# Altium schematic sheet ADC_channel.SchDoc: =ProjectName
size 420 x 297 mm; Author: SBH; CompanyName: WUT; DrawnBy: SBH; Organization: ISE-WUT; Address1: Warsaw Univeristy of Technology; Address2: Nowowiejska 15/19; Revision: -; SheetNumber: -; SheetTotal: -; EDA_Number: ARTIQ; Projet: ADC/DAC MEZZANINE; ModifiedBy: -; CreateDate: XX/XX/XXXX; CheckedDate: -; Title2: ADC_channel.SchDoc; DivGrp: ISE; Designer: SBH; ModifiedDate: -; ProjectName: ADC/DAC MEZZANINE
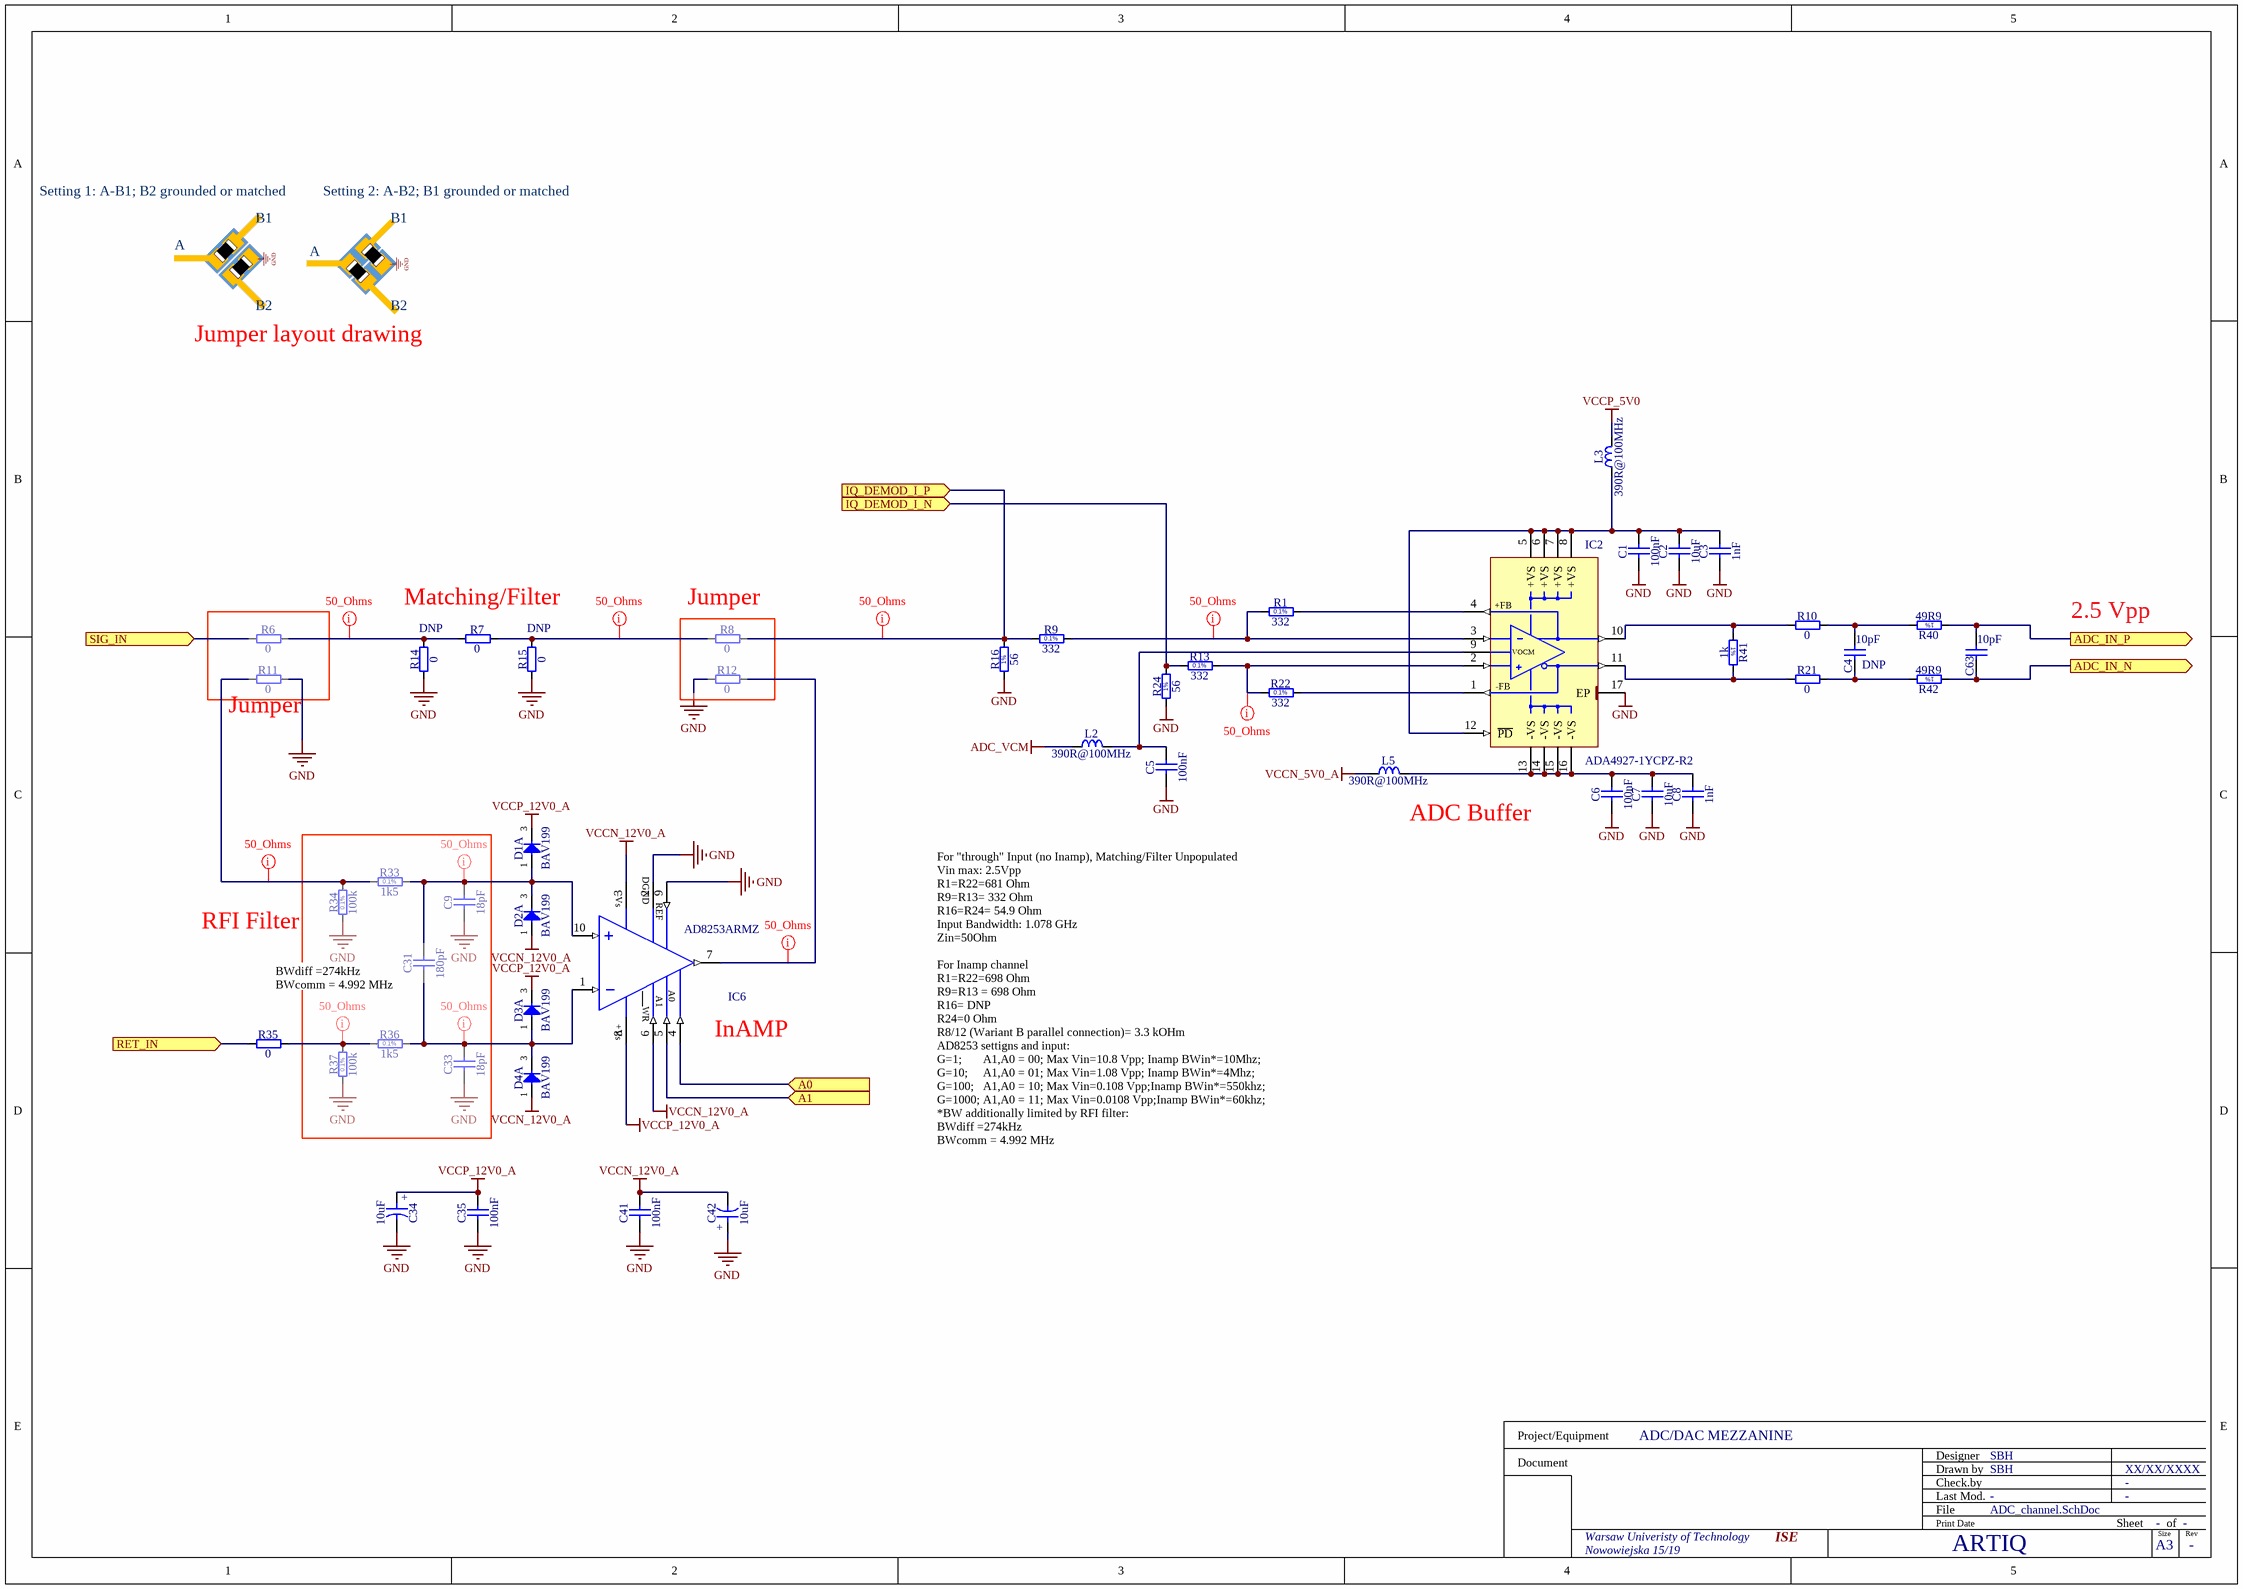
[diagram p0: ADC_channel.SchDoc]

## Parts
C1  100nF  [CAPC1005X55N]
C2  10uF  [CAPC1608X87N]
C3  1nF  [CAPC1005X55N]
C4  10pF  Mounted: DNP  [CAPC1608X87N]
C5  100nF  [CAPC1005X55N]
C6  100nF  [CAPC1005X55N]
C7  10uF  [CAPC1608X87N]
C8  1nF  [CAPC1005X55N]
C9  18pF  [CAPC1005X55N]
C31  180pF  [CAPC3216X140N]
C33  18pF  [CAPC1005X55N]
C34  10uF  [CAPMP3216X180N]
C35  100nF  [CAPC1005X55N]
C41  100nF  [CAPC1005X55N]
C42  10uF  [CAPMP3216X180N]
C63  10pF  [CAPC1608X87N]
D1  BAV199  [SOT95P240X110-3N]  (part A of 2)
D2  BAV199  [SOT95P240X110-3N]  (part A of 2)
D3  BAV199  [SOT95P240X110-3N]  (part A of 2)
D4  BAV199  [SOT95P240X110-3N]  (part A of 2)
IC2  ADA4927-1YCPZ-R2  [QFN50P300X300X100-17N-S145]
IC6  AD8253ARMZ  [SOP50P490X110-10N]
L2  390R@100MHz  [INDC1608X95N]
L3  390R@100MHz  [INDC1608X95N]
L5  390R@100MHz  [INDC1608X95N]
R1  332  [RESC1608X55N]
R6  0  [RESC1005X40N]
R7  0  [RESC1005X40N]
R8  0  [RESC1005X40N]
R9  332  [RESC1608X55N]
R10  0  [RESC1005X40N]
R11  0  [RESC1005X40N]
R12  0  [RESC1005X40N]
R13  332  [RESC1608X55N]
R14  0  Mounted: DNP  [RESC1005X40N]
R15  0  Mounted: DNP  [RESC1005X40N]
R16  56  [RESC1005X40N]
R21  0  [RESC1005X40N]
R22  332  [RESC1608X55N]
R24  56  [RESC1005X40N]
R33  1k5  [RESC1608X55N]
R34  100k  [RESC1005X35N]
R35  0  [RESC1005X40N]
R36  1k5  [RESC1608X55N]
R37  100k  [RESC1005X35N]
R40  49R9  [RESC1005X40N]
R41  1k  [RESC1005X40N]
R42  49R9  [RESC1005X40N]

## Blocks framed on the sheet
Jumper: R8 R12

## Ports
A0 (in), A1 (in), ADC_IN_N (out), ADC_IN_P (out), IQ_DEMOD_I_N (in), IQ_DEMOD_I_P (in), RET_IN (in), SIG_IN (in)

## Nets
ADC_VCM: L2.1
GND: C1.1 C2.1 C3.1 C5.1 C6.1 C7.1 C8.1 C9.1 C33.1 C34.2 C35.1 C41.1 C42.1 IC2.17(EP) IC6.2(DGND) IC6.9(REF) R11.2 R12.2 R14.1 R15.1 R16.1 R24.1 R34.1 R37.1
VCCN_5V0_A: L5.1
VCCN_12V0_A: C41.2 C42.2 D2.1(A) D4.1(A) IC6.3(-VS) IC6.6(~{WR})
VCCP_5V0: L3.2
VCCP_12V0_A: C34.1 C35.2 D1.3(COMAC) D3.3(COMAC) IC6.8(+VS)
A0: IC6.4(A0) ; port A0
A1: IC6.5(A1) ; port A1
ADC_IN_N: C63.1 R42.1 ; port ADC_IN_N
ADC_IN_P: C63.2 R40.1 ; port ADC_IN_P
IQ_DEMOD_I_N: R13.1 R24.2 ; port IQ_DEMOD_I_N
IQ_DEMOD_I_P: R8.1 R9.1 R16.2 ; port IQ_DEMOD_I_P
RET_IN: R35.1 ; port RET_IN
SIG_IN: R6.1 ; port SIG_IN
NetC1_2: C1.2 C2.2 C3.2 IC2.5(+VS) IC2.6(+VS) IC2.7(+VS) IC2.8(+VS) IC2.12(~{PD}) L3.1
NetC4_1: C4.1 R21.2 R42.2
NetC4_2: C4.2 R10.2 R40.2
NetC5_2: C5.2 IC2.9(VOCM) L2.2
NetC6_2: C6.2 C7.2 C8.2 IC2.13(-VS) IC2.14(-VS) IC2.15(-VS) IC2.16(-VS) L5.2
NetC9_2: C9.2 C31.2 D1.1(A) D2.3(COMAC) IC6.10(+IN) R33.2
NetC31_1: C31.1 C33.2 D3.1(A) D4.3(COMAC) IC6.1(-IN) R36.2
NetIC2_1: IC2.1(-FB) R22.2
NetIC2_2: IC2.2(+IN) R13.2 R22.1
NetIC2_3: IC2.3(-IN) R1.1 R9.2
NetIC2_4: IC2.4(+FB) R1.2
NetIC2_10: IC2.10(+OUT) R10.1 R41.1
NetIC2_11: IC2.11(-OUT) R21.1 R41.2
NetIC6_7: IC6.7(OUT) R12.1
NetR6_2: R6.2 R7.1 R14.2
NetR7_2: R7.2 R8.2 R15.2
NetR11_1: R11.1 R33.1 R34.2
NetR35_2: R35.2 R36.1 R37.2

## Layout directives
net class 50_Ohms: IQ_DEMOD_I_P, NetC9_2, NetC31_1, NetIC2_2, NetIC2_3, NetIC6_7, NetR6_2, NetR7_2, NetR11_1, NetR35_2

## Notes on the sheet
- Setting 1: A-B1; B2 grounded or matched
- A
- B1
- Setting 2: A-B2; B1 grounded or matched
- B2
- Jumper layout drawing
- Matching/Filter
- 2.5 Vpp
- (near R11) Jumper
- (near L5) ADC Buffer
- (near R34) RFI Filter
- (near C31) BWdiff =274kHz
  BWcomm = 4.992 MHz
- (near IC6) InAMP
- For "through" Input (no Inamp), Matching/Filter Unpopulated
  Vin max: 2.5Vpp
  R1=R22=681 Ohm
  R9=R13= 332 Ohm
  R16=R24= 54.9 Ohm
  Input Bandwidth: 1.078 GHz
  Zin=50Ohm
  For Inamp channel
  R1=R22=698 Ohm
  R9=R13 = 698 Ohm
  R16= DNP
  R24=0 Ohm
  R8/12 (Wariant B parallel connection)= 3.3 kOHm
  AD8253 settigns and input:
  G=1;       A1,A0 = 00; Max Vin=10.8 Vpp; Inamp BWin*=10Mhz;
  G=10;     A1,A0 = 01; Max Vin=1.08 Vpp; Inamp BWin*=4Mhz;
  G=100;   A1,A0 = 10; Max Vin=0.108 Vpp;Inamp BWin*=550khz;
  G=1000; A1,A0 = 11; Max Vin=0.0108 Vpp;Inamp BWin*=60khz;
  *BW additionally limited by RFI filter:
  BWdiff =274kHz
  BWcomm = 4.992 MHz
- Project/Equipment
- Document
- Designer
- Drawn by
- Check.by
- File
- Last Mod.
- Print Date
- Sheet
- Size
- A3
- of
- Rev
- (in symbol AD8253ARMZ) -Vs; WR; +Vs
- (in symbol CTE3216-18_10UF_16V_20%_AVX_TCJ) +
- (in symbol R0402_1K_1%_0.0625W_100PPM) 1%
- (in symbol R0402_49R9_1%_0.0625W_100PPM) 1%
- (in symbol R0402_56R_1%_0.0625W_100PPM) 1%
- (in symbol R0402_100K_0.1%_0.063W_25PPM) 0.1%
- (in symbol R0603_1K5_0.1%_0.063W_10PPM) 0.1%
- (in symbol R0603_332R_0.1%_0.063W_10PPM) 0.1%

## Library data of the parts
C1 C5 C6 = CC0402_100NF_16V_10%_X5R: Non-polarised capacitor; Part Description: SMD Multilayer Chip Ceramic Capacitor; Manufacturer: GENERIC; Manufacturer1 Part Number: GRM155R61C104KA88D; Voltage: 16V; TC: X5R; Tolerance: ±10%; Part Number: CC0402_100NF_16V_10%_X5R; Component Kind: Standard; Component Type: Standard; Pin Count: 2; Value: 100nF; Status: None; Manufacturer Part Number: CC0402_100NF_16V_10%_X5R; Case: 0402; Mounted: Yes; Socket: No; SMD: Yes; Sense: No; Manufacturer1 Example: MURATA; Manufacturer1 ComponentHeight: 0.55mm; HelpURL: \\cern.ch\dfs\Applications\Altium\Datasheets\CC0402_X5R_MURATA_GRM.pdf; Author: CERN DEM JLC; CreateDate: 10.12.2013; LatestRevisionDate: 10.12.2013
C2 C7 = CC0603_10UF_6.3V_20%_X5R: Non-polarised capacitor; Part Description: SMD Multilayer Chip Ceramic Capacitor; Manufacturer: GENERIC; Manufacturer1 Part Number: C0603C106M9PAC; Voltage: 6.3V; TC: X5R; Tolerance: ±20%; Part Number: CC0603_10UF_6.3V_20%_X5R; Component Kind: Standard; Component Type: Standard; Pin Count: 2; Value: 10uF; Status: Preferred; Manufacturer Part Number: CC0603_10uF_6.3V_20%_X5R; Case: 0603; Mounted: Yes; Socket: No; SMD: Yes; Sense: No; Manufacturer1 Example: KEMET; Manufacturer1 ComponentHeight: 0.95mm; HelpURL: \\cern.ch\dfs\Applications\Altium\Datasheets\CC0603_X5R_KEMET.pdf; Author: CERN DEM JLC; CreateDate: 03.12.2007; LatestRevisionDate: 03.12.2007
C3 C8 = CC0402_1NF_50V_10%_X7R: Non-polarised capacitor; Part Description: SMD Multilayer Chip Ceramic Capacitor; Manufacturer: GENERIC; Manufacturer1 Part Number: 223858715623; Voltage: 50V; TC: X7R; Tolerance: ±10%; Part Number: CC0402_1NF_50V_10%_X7R; Component Kind: Standard; Component Type: Standard; Pin Count: 2; Value: 1nF; Status: Not Recommended; Manufacturer Part Number: CC0402_1NF_50V_10%_X7R; Case: 0402; Mounted: Yes; Socket: No; SMD: Yes; Sense: No; Manufacturer1 Example: PHYCOMP; Manufacturer1 ComponentHeight: 0.55mm; HelpURL: \\cern.ch\dfs\Applications\Altium\Datasheets\CC0402_X7R_PHYCOMP.pdf; Author: CERN DEM JLC; CreateDate: 03.12.2007; LatestRevisionDate: 03.12.2007
C4 C63 = CC0603_10PF_50V_5%_NP0: Non-polarised capacitor; Part Description: SMD Multilayer Chip Ceramic Capacitor; Manufacturer: GENERIC; Manufacturer1 Part Number: 223886715109; Voltage: 50V; TC: C0G/NP0; Tolerance: ±5%; Part Number: CC0603_10PF_50V_5%_NP0; Component Kind: Standard; Component Type: Standard; Pin Count: 2; Value: 10pF; Status: Preferred; Manufacturer Part Number: CC0603_10PF_50V_5%_NP0; Case: 0603; Socket: No; SMD: Yes; Sense: No; Manufacturer1 Example: PHYCOMP; Manufacturer1 ComponentHeight: 0.87mm; HelpURL: \\cern.ch\dfs\Applications\Altium\Datasheets\CC0603_NP0_PHYCOMP.pdf; Author: CERN DEM JLC; CreateDate: 03.12.2007; LatestRevisionDate: 03.12.2007
  C63: Mounted: Yes
C9 C33 = CC0402_18PF_50V_5%_C0G: Non-polarised capacitor; Part Description: SMD Multilayer Chip Ceramic Capacitor; Manufacturer: GENERIC; Manufacturer1 Part Number: C0402C180J5GACTU; Voltage: 50V; TC: C0G/NP0; Tolerance: ±5%; Part Number: CC0402_18PF_50V_5%_C0G; Component Kind: Standard; Component Type: Standard; Pin Count: 2; Value: 18pF; Status: Preferred; Manufacturer Part Number: CC0402_18PF_50V_5%_C0G; Case: 0402; Mounted: Yes; Socket: No; SMD: Yes; Sense: No; Manufacturer1 Example: KEMET; Manufacturer1 ComponentHeight: 0.55mm; HelpURL: \\cern.ch\dfs\Applications\Altium\Datasheets\CC0805_C0G_KEMET_(Commercial Grade).pdf; Author: CERN DEM JLC; CreateDate: 2016-10-04; LatestRevisionDate: 2016-10-04
C31 = CC1206_180PF_50V_5%_NP0: Non-polarised capacitor; Part Description: SMD Multilayer Chip Ceramic Capacitor; Manufacturer: GENERIC; Manufacturer1 Part Number: VJ1206A181JXAAT; Voltage: 50V; TC: C0G/NP0; Tolerance: ±5%; Part Number: CC1206_180PF_50V_5%_NP0; Component Kind: Standard; Component Type: Standard; Pin Count: 2; Value: 180pF; Status: Preferred; Manufacturer Part Number: CC1206_180PF_50V_5%_NP0; Case: 1206; Mounted: Yes; Socket: No; SMD: Yes; Sense: No; Manufacturer1 Example: VISHAY VITRAMON; Manufacturer1 ComponentHeight: 1.7mm; HelpURL: \\cern.ch\dfs\Applications\Altium\Datasheets\CC1206_NP0_VISHAY_VJ.pdf; Author: CERN DEM JLC; CreateDate: 2007-12-03; LatestRevisionDate: 2007-12-03
C34 C42 = CTE3216-18_10UF_16V_20%_AVX_TCJ: Polarised capacitor; Part Description: ESR 0R200 Tantalum Solid Electrolytic Chip Capacitor with Conductive Polymer Electrode; Manufacturer: AVX; Manufacturer Part Number: TCJA106M016R0200; Voltage: 16V; Tolerance: ±20%; Part Number: CTE3216-18_10UF_16V_20%_AVX_TCJ; Component Kind: Standard; Component Type: Standard; Pin Count: 2; Value: 10uF; Status: Preferred; Case: A; Mounted: Yes; Socket: No; SMD: Yes; Sense: No; HelpURL: \\cern.ch\dfs\Applications\Altium\Datasheets\CTE_AVX_TCJ.pdf; Author: CERN DEM JLC; CreateDate: 2012-03-29; LatestRevisionDate: 2012-03-29; ComponentHeight: 1.8mm
C35 C41 = CC0402_100NF_16V_10%_X7R: Non-polarised capacitor; Part Description: SMD Multilayer Chip Ceramic Capacitor; Manufacturer: GENERIC; Manufacturer1 Part Number: GRM155R71C104KA88D; Voltage: 16V; TC: X7R; Tolerance: ±10%; Part Number: CC0402_100NF_16V_10%_X7R; Component Kind: Standard; Component Type: Standard; Pin Count: 2; Value: 100nF; Status: Not Recommended; Manufacturer Part Number: CC0402_100NF_16V_10%_X7R; Case: 0402; Mounted: Yes; Socket: No; SMD: Yes; Sense: No; Manufacturer1 Example: MURATA; Manufacturer1 ComponentHeight: 0.55mm; HelpURL: \\cern.ch\dfs\Applications\Altium\Datasheets\CC0402_X7R_MURATA_GRM.pdf; Author: CERN DEM JLC; CreateDate: 2013-12-05; LatestRevisionDate: 2007-12-03
D1-D4 = BAV199: Serial Diode; Part Description: Low-Leakage Double Diode; Manufacturer: NXP SEMICONDUCTORS; Voltage: 75V; Power: 250mW; PressFit: No; Bonding: No; Part Number: BAV199; Component Kind: Standard; Component Type: Standard; Device: BAV199; PackageDescription: SOT23 3-Leads, Pitch 0.95mm - Body 1.4x3mm, IPC Medium Density; Manufacturer Part Number: BAV199; Pin Count: 3; Case: SOT23-3; Mounted: Yes; Socket: No; SMD: Yes; Sense: No; ComponentHeight: 1.1mm; HelpURL: \\cern.ch\dfs\Applications\Altium\Datasheets\BAV199.pdf; Author: CERN DEM JMW; CreateDate: 2008-11-21; LatestRevisionDate: 2008-11-21
IC2 = ADA4927-1YCPZ-R2: Ultralow Distortion Current Feedback Differential ADC Driver; Manufacturer: ANALOG DEVICES; PressFit: No; Bonding: No; Part Number: ADA4927-1YCPZ-R2; Component Kind: Standard; Component Type: Standard; Device: ADA4927-1YCPZ-R2; PackageDescription: QFN,0.50mm pitch,square; 4 pin X 4 pin, 3mm X 3mm X 1.00mm H body (w/thermal tab 1.45 X 1.45mm),  IPC Medium Density; Part Description: Ultralow Distortion Current Feedback Differential ADC Driver; Manufacturer Part Number: ADA4927-1YCPZ-R2; Pin Count: 17; Case: QFN16; Mounted: Yes; Socket: No; SMD: Yes; Sense: No; ComponentHeight: 1mm; Author: CERN DEM JLC; HelpURL: \\cern.ch\dfs\Applications\Altium\Datasheets\ADA4927-1YCPZ-R2.pdf; CreateDate: 19.04.2010; LatestRevisionDate: 19.04.2010
IC6 = AD8253ARMZ: 10MHz, 20V/us, G= 1, 10, 100, 1000 iCMOS Programmable Gain Instrumentation Amplifier; Manufacturer: ANALOG DEVICES; PressFit: No; Bonding: No; Part Number: AD8253ARMZ; Component Kind: Standard; Component Type: Standard; Device: AD8253ARMZ; PackageDescription: MSOP, 10-Leads, Body 3.1x3.1mm (max), Pitch 0.50mm, IPC Medium Density; Part Description: 10MHz, 20V/us, G= 1, 10, 100, 1000 iCMOS Programmable Gain Instrumentation Amplifier; Manufacturer Part Number: AD8253ARMZ; Pin Count: 8; Case: MSOP10; Mounted: Yes; Socket: No; SMD: Yes; Sense: No; ComponentHeight: 1.1mm; Author: CERN DEM JLC; HelpURL: \\cern.ch\dfs\Applications\Altium\Datasheets\AD8253ARMZ.pdf; CreateDate: 2013-10-02; LatestRevisionDate: 2013-10-02
L2 L3 L5 = IND0603_TDK_MPZ1608R391A: Inductor; Part Description: SMT Chip Bead for Power Line; Manufacturer: TDK; Power: 1.2A; Resistance: 0.12R; Tolerance: ±25%; Part Number: IND0603_TDK_MPZ1608R391A; Component Kind: Standard; Component Type: Standard; Pin Count: 2; Value: 390R@100MHz; Status: None; Manufacturer Part Number: MPZ1608R391A; Case: 0603; Mounted: Yes; Socket: No; SMD: Yes; Sense: No; ComponentHeight: 0.95mm; HelpURL: \\cern.ch\dfs\Applications\Altium\Datasheets\IND0603_TDK_MPZ1608.pdf; Author: CERN DEM JLC; CreateDate: 2009-12-02; LatestRevisionDate: 2009-12-02
R1 R9 R13 R22 = R0603_332R_0.1%_0.063W_10PPM: Resistor - 0.1%; Part Description: Thin Film Chip Resistor; Manufacturer: GENERIC; Manufacturer1 Part Number: RN73C1J332RBTDF; Power: 0.063W; TC: ±10ppm; Part Number: R0603_332R_0.1%_0.063W_10PPM; Component Kind: Standard; Component Type: Standard; Pin Count: 2; Value: 332; Status: Not recommended; Tolerance: ±0.1%; Manufacturer Part Number: R0603_332R_0.1%_0.063W_10PPM; Case: 0603; Mounted: Yes; Sense: No; Socket: No; SMD: Yes; Manufacturer1 Example: TYCO HOLSWORTHY; Manufacturer1 ComponentHeight: 0.5mm; HelpURL: \\cern.ch\dfs\Applications\Altium\Datasheets\R0603_Tyco_RN73.pdf; Author: CERN DEM JLC; CreateDate: 03.12.2007; LatestRevisionDate: 13.03.2008
R6-R8 R10-R12 R14 R15 R21 R35 = R0402_0R_JUMPER: Resistor; Part Description: 1A (0.05R Max DC Resistance) Zero Ohm Jumper; Manufacturer: GENERIC; Manufacturer1 Part Number: 232270591001L; Part Number: R0402_0R_JUMPER; Component Kind: Standard; Component Type: Standard; Pin Count: 2; Value: 0; Status: Not recommended; Manufacturer Part Number: R0402_0R_JUMPER; Case: 0402; Sense: No; Socket: No; SMD: Yes; Manufacturer1 Example: YAGEO PHYCOMP; Manufacturer1 ComponentHeight: 0.4mm; HelpURL: \\cern.ch\dfs\Applications\Altium\Datasheets\R0402_Phycomp_RC0402.pdf; Author: CERN DEM JLC; CreateDate: 2007-12-03; LatestRevisionDate: 2012-10-17
  R6-R8 R10-R12 R21 R35: Mounted: Yes
R16 R24 = R0402_56R_1%_0.0625W_100PPM: Resistor - 1%; Part Description: General Purpose Thick Film Chip Resistor; Manufacturer: GENERIC; Manufacturer1 Part Number: 232270675609L; TC: ±100ppm/°C; Part Number: R0402_56R_1%_0.0625W_100PPM; Component Kind: Standard; Component Type: Standard; Pin Count: 2; Value: 56; Status: Not recommended; Power: 0.0625W; Tolerance: ±1%; Manufacturer Part Number: R0402_56R_1%_0.0625W_100PPM; Case: 0402; Mounted: Yes; Sense: No; Socket: No; SMD: Yes; Manufacturer1 Example: YAGEO PHYCOMP; Manufacturer1 ComponentHeight: 0.4mm; HelpURL: \\cern.ch\dfs\Applications\Altium\Datasheets\R0402_Phycomp_RC0402.pdf; Author: CERN DEM JLC; CreateDate: 03.12.2007; LatestRevisionDate: 17.10.2012
R33 R36 = R0603_1K5_0.1%_0.063W_10PPM: Resistor - 0.1%; Part Description: Thin Film Chip Resistor; Manufacturer: GENERIC; Manufacturer1 Part Number: RN73C1J1K5BTDF; Power: 0.063W; TC: ±10ppm; Part Number: R0603_1K5_0.1%_0.063W_10PPM; Component Kind: Standard; Component Type: Standard; Pin Count: 2; Value: 1k5; Status: Not recommended; Tolerance: ±0.1%; Manufacturer Part Number: R0603_1K5_0.1%_0.063W_10PPM; Case: 0603; Mounted: Yes; Sense: No; Socket: No; SMD: Yes; Manufacturer1 Example: TYCO HOLSWORTHY; Manufacturer1 ComponentHeight: 0.5mm; HelpURL: \\cern.ch\dfs\Applications\Altium\Datasheets\R0603_Tyco_RN73.pdf; Author: CERN DEM JLC; CreateDate: 2007-12-03; LatestRevisionDate: 2008-03-13
R34 R37 = R0402_100K_0.1%_0.063W_25PPM: Resistor - 0.1%; Part Description: Thin Film Precision Resistor; Manufacturer: GENERIC; Manufacturer1 Part Number: CPF0402B100KE1; Power: 0.063W; TC: ±25ppm/°C; Part Number: R0402_100K_0.1%_0.063W_25PPM; Component Kind: Standard; Component Type: Standard; Pin Count: 2; Value: 100k; Status: Not Recommended; Tolerance: ±0.1%; Manufacturer Part Number: R0402_100K_0.1%_0.063W_25PPM; Case: 0402; Mounted: Yes; Sense: No; Socket: No; SMD: Yes; Manufacturer1 Example: TE CONNECTIVITY; Manufacturer1 ComponentHeight: 0.35mm; HelpURL: \\cern.ch\dfs\Applications\Altium\Datasheets\R0402_TYCO_CPF.pdf; Author: CERN DEM JMW; CreateDate: 2015-09-22; LatestRevisionDate: 2015-09-22
R40 R42 = R0402_49R9_1%_0.0625W_100PPM: Resistor - 1%; Part Description: General Purpose Thick Film Chip Resistor; Manufacturer: GENERIC; Manufacturer1 Part Number: 232270674999L or RC0402FR-0749R9L; TC: ±100ppm/°C; Part Number: R0402_49R9_1%_0.0625W_100PPM; Component Kind: Standard; Component Type: Standard; Pin Count: 2; Value: 49R9; Status: Not recommended; Power: 0.0625W; Tolerance: ±1%; Manufacturer Part Number: R0402_49R9_1%_0.0625W_100PPM; Case: 0402; Mounted: Yes; Sense: No; Socket: No; SMD: Yes; Manufacturer1 Example: YAGEO PHYCOMP; Manufacturer1 ComponentHeight: 0.4mm; HelpURL: \\cern.ch\dfs\Applications\Altium\Datasheets\R0402_Phycomp_RC0402.pdf; Author: CERN DEM JLC; CreateDate: 24.10.2012; LatestRevisionDate: 24.10.2012
R41 = R0402_1K_1%_0.0625W_100PPM: Resistor - 1%; Part Description: General Purpose Thick Film Chip Resistor; Manufacturer: GENERIC; Manufacturer1 Part Number: 232270671002L; TC: ±100ppm/°C; Part Number: R0402_1K_1%_0.0625W_100PPM; Component Kind: Standard; Component Type: Standard; Pin Count: 2; Value: 1k; Status: Not recommended; Power: 0.0625W; Tolerance: ±1%; Manufacturer Part Number: R0402_1K_1%_0.0625W_100PPM; Case: 0402; Mounted: Yes; Sense: No; Socket: No; SMD: Yes; Manufacturer1 Example: YAGEO PHYCOMP; Manufacturer1 ComponentHeight: 0.4mm; HelpURL: \\cern.ch\dfs\Applications\Altium\Datasheets\R0402_Phycomp_RC0402.pdf; Author: CERN DEM JLC; CreateDate: 2007-12-03; LatestRevisionDate: 2012-10-17